# Altium schematic sheet PC3_Audio_Output.SchDoc
size 250 x 200 mm
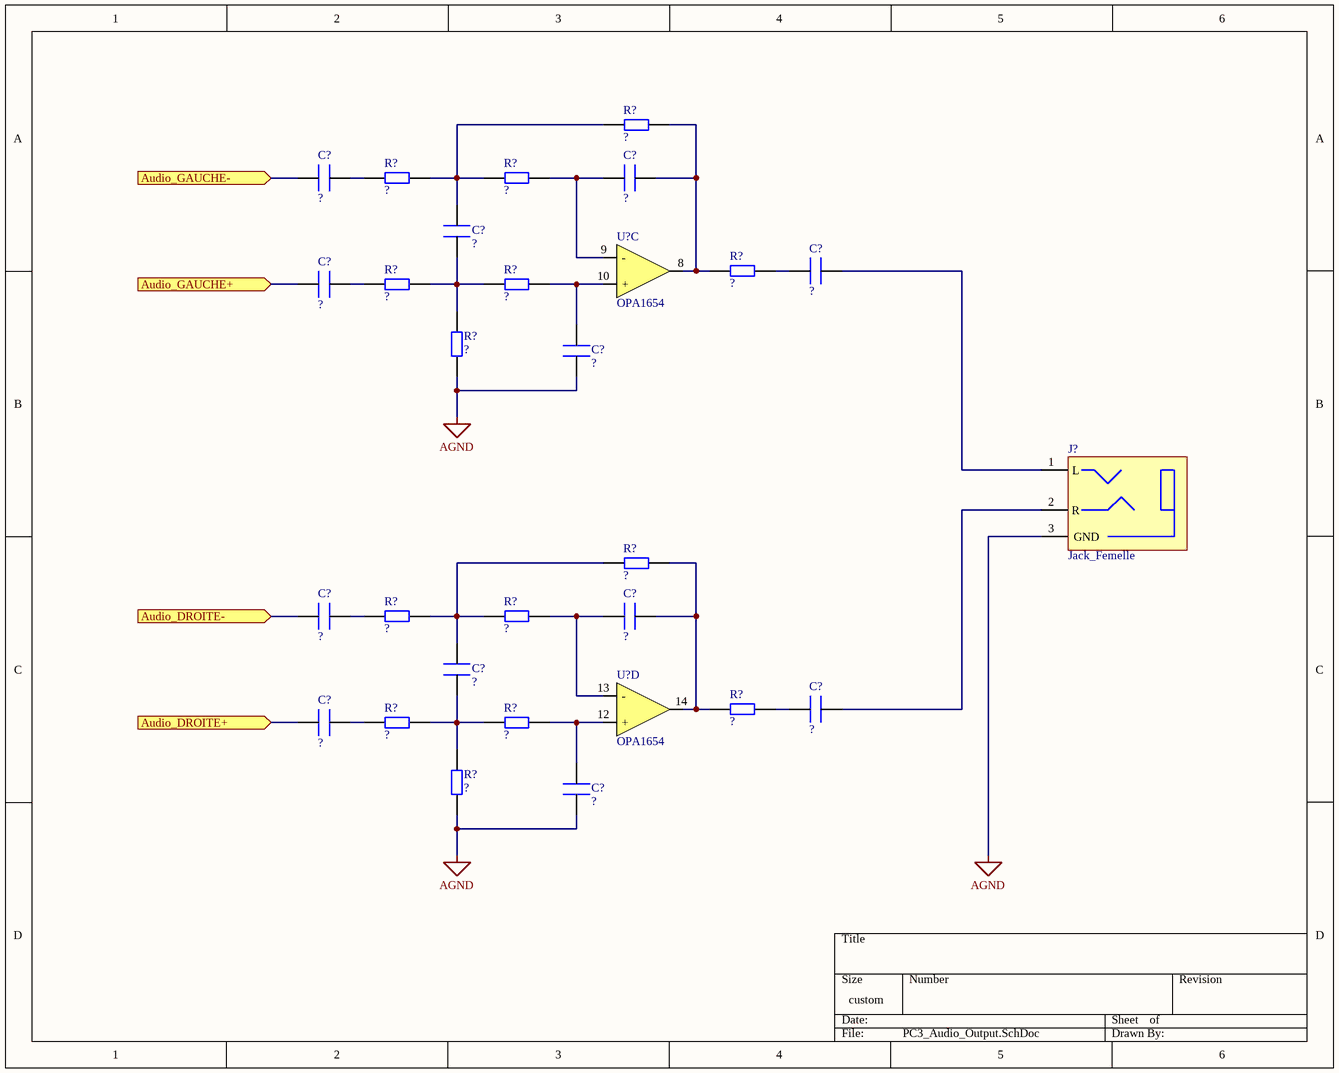
[diagram p0: PC3_Audio_Output.SchDoc]

## Parts
(Parts that share a designator on the sheet are numbered #1, #2 ... from top to bottom, then left to right.)
C?#1  Condo  (value not drawn)  (no BOM)
C?#2  Condo  (value not drawn)  (no BOM)
C?#3  Condo  (value not drawn)  (no BOM)
C?#4  Condo  (value not drawn)  (no BOM)
C?#5  Condo  (value not drawn)  (no BOM)
C?#6  Condo  (value not drawn)  (no BOM)
C?#7  Condo  (value not drawn)  (no BOM)
C?#8  Condo  (value not drawn)  (no BOM)
C?#9  Condo  (value not drawn)  (no BOM)
C?#10  Condo  (value not drawn)  (no BOM)
C?#11  Condo  (value not drawn)  (no BOM)
C?#12  Condo  (value not drawn)  (no BOM)
J?  Jack_Femelle
R?#1  Res  (value not drawn)  (no BOM)
R?#2  Res  (value not drawn)  (no BOM)
R?#3  Res  (value not drawn)  (no BOM)
R?#4  Res  (value not drawn)  (no BOM)
R?#5  Res  (value not drawn)  (no BOM)
R?#6  Res  (value not drawn)  (no BOM)
R?#7  Res  (value not drawn)  (no BOM)
R?#8  Res  (value not drawn)  (no BOM)
R?#9  Res  (value not drawn)  (no BOM)
R?#10  Res  (value not drawn)  (no BOM)
R?#11  Res  (value not drawn)  (no BOM)
R?#12  Res  (value not drawn)  (no BOM)
R?#13  Res  (value not drawn)  (no BOM)
R?#14  Res  (value not drawn)  (no BOM)
U?#1  OPA1654  (part C of 5)
U?#2  OPA1654  (part D of 5)

## Ports
Audio_DROITE+ (in), Audio_DROITE- (in), Audio_GAUCHE+ (in), Audio_GAUCHE- (in)

## Nets
AGND: C?#6.1 C?#12.1 J?.3(GND) R?#7.1 R?#14.1
Audio_DROITE+: C?#11.1 ; port Audio_DROITE+
Audio_DROITE-: C?#8.1 ; port Audio_DROITE-
Audio_GAUCHE+: C?#5.1 ; port Audio_GAUCHE+
Audio_GAUCHE-: C?#2.1 ; port Audio_GAUCHE-
NetC?#1_1: C?#1.1 R?#1.2 R?#4.2 U?#1.8(OUT)
NetC?#1_2: C?#1.2 R?#3.2 U?#1.9(-)
NetC?#2_2: C?#2.2 R?#2.1
NetC?#3_1: C?#3.1 R?#5.2 R?#6.1 R?#7.2
NetC?#3_2: C?#3.2 R?#1.1 R?#2.2 R?#3.1
NetC?#4_1: C?#4.1 J?.1(L)
NetC?#4_2: C?#4.2 R?#4.1
NetC?#5_2: C?#5.2 R?#5.1
NetC?#6_2: C?#6.2 R?#6.2 U?#1.10(+)
NetC?#7_1: C?#7.1 R?#8.2 R?#11.2 U?#2.14(OUT)
NetC?#7_2: C?#7.2 R?#10.2 U?#2.13(-)
NetC?#8_2: C?#8.2 R?#9.1
NetC?#9_1: C?#9.1 R?#12.2 R?#13.1 R?#14.2
NetC?#9_2: C?#9.2 R?#8.1 R?#9.2 R?#10.1
NetC?#10_1: C?#10.1 J?.2(R)
NetC?#10_2: C?#10.2 R?#11.1
NetC?#11_2: C?#11.2 R?#12.1
NetC?#12_2: C?#12.2 R?#13.2 U?#2.12(+)

## Library data of the parts
C?#1-C?#12 = Condo: Condensateur; Valeur: ?
J? = Jack_Femelle: Prise Mini Jack Stéréo Femelle
R?#1-R?#14 = Res: Résistance; Valeur: ?
U?#1 U?#2 = OPA1654: Quad Audio AmpliOp; Fabricant: TEXAS INSTRUMENTS; RefFabricant: OPA1654; DataSheet: http://www.ti.com/lit/ds/symlink/opa1654.pdf